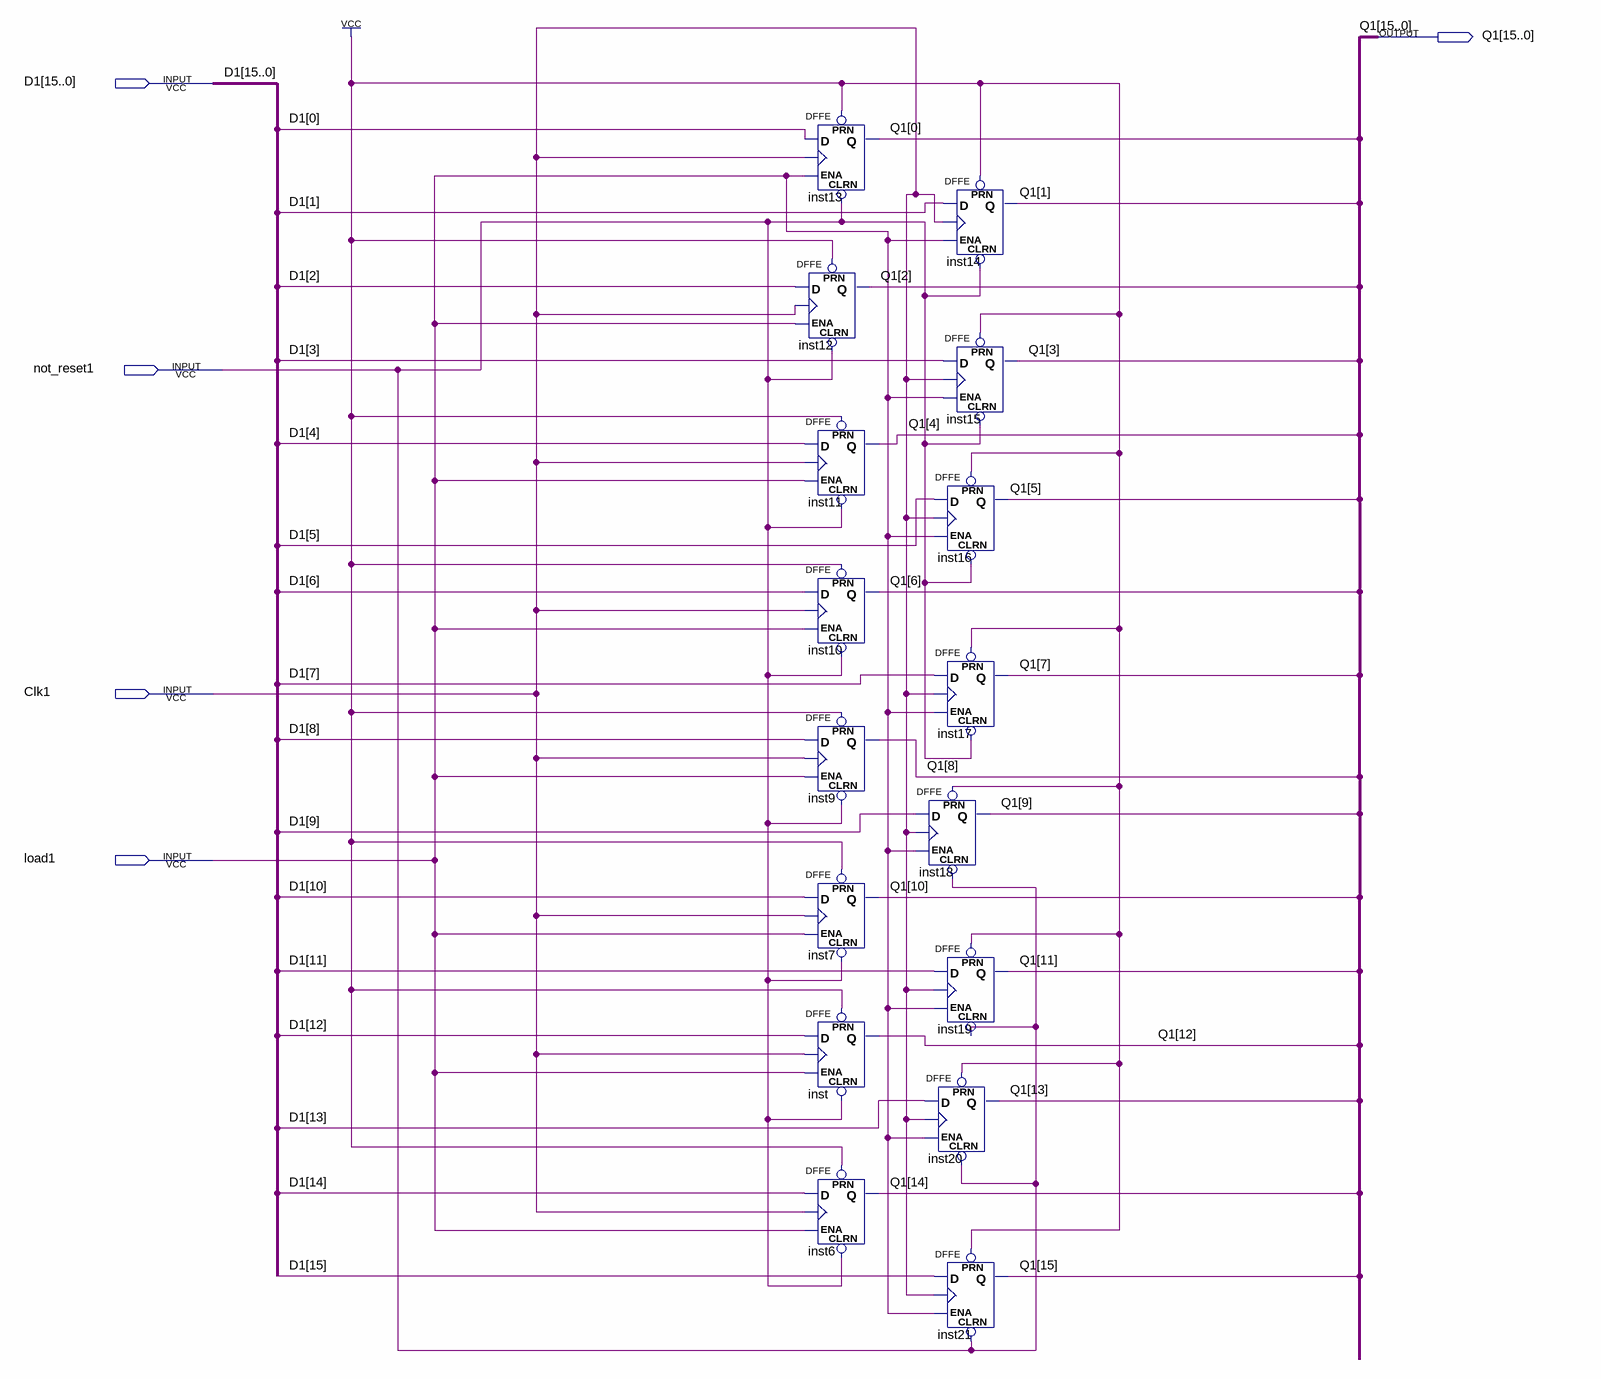
[diagram p0: schematic sheet]
// Quartus schematic register_16bit.bdf as structural Verilog: 16 symbols, 5 pins
module register_16bit (
  input  [15:0] D1,
  input  not_reset1,
  input  Clk1,
  input  load1,
  output [15:0] Q1
);

  DFFE inst13 (.PRN(1'b1), .CLRN(not_reset1), .D(D1[0]), .CLK(Clk1), .ENA(load1), .Q(Q1[0]));
  DFFE inst12 (.PRN(1'b1), .CLRN(not_reset1), .D(D1[2]), .CLK(Clk1), .ENA(load1), .Q(Q1[2]));
  DFFE inst11 (.PRN(1'b1), .CLRN(not_reset1), .D(D1[4]), .CLK(Clk1), .ENA(load1), .Q(Q1[4]));
  DFFE inst10 (.PRN(1'b1), .CLRN(not_reset1), .D(D1[6]), .CLK(Clk1), .ENA(load1), .Q(Q1[6]));
  DFFE inst9 (.PRN(1'b1), .CLRN(not_reset1), .D(D1[8]), .CLK(Clk1), .ENA(load1), .Q(Q1[8]));
  DFFE inst7 (.PRN(1'b1), .CLRN(not_reset1), .D(D1[10]), .CLK(Clk1), .ENA(load1), .Q(Q1[10]));
  DFFE inst (.PRN(1'b1), .CLRN(not_reset1), .D(D1[12]), .CLK(Clk1), .ENA(load1), .Q(Q1[12]));
  DFFE inst6 (.PRN(1'b1), .CLRN(not_reset1), .D(D1[14]), .CLK(Clk1), .ENA(load1), .Q(Q1[14]));
  DFFE inst14 (.PRN(1'b1), .CLRN(not_reset1), .D(D1[1]), .CLK(Clk1), .ENA(load1), .Q(Q1[1]));
  DFFE inst15 (.PRN(1'b1), .CLRN(not_reset1), .D(D1[3]), .CLK(Clk1), .ENA(load1), .Q(Q1[3]));
  DFFE inst16 (.PRN(1'b1), .CLRN(not_reset1), .D(D1[5]), .CLK(Clk1), .ENA(load1), .Q(Q1[5]));
  DFFE inst17 (.PRN(1'b1), .CLRN(not_reset1), .D(D1[7]), .CLK(Clk1), .ENA(load1), .Q(Q1[7]));
  DFFE inst18 (.PRN(1'b1), .CLRN(not_reset1), .D(D1[9]), .CLK(Clk1), .ENA(load1), .Q(Q1[9]));
  DFFE inst19 (.PRN(1'b1), .CLRN(not_reset1), .D(D1[11]), .CLK(Clk1), .ENA(load1), .Q(Q1[11]));
  DFFE inst20 (.PRN(1'b1), .CLRN(not_reset1), .D(D1[13]), .CLK(Clk1), .ENA(load1), .Q(Q1[13]));
  DFFE inst21 (.PRN(1'b1), .CLRN(not_reset1), .D(D1[15]), .CLK(Clk1), .ENA(load1), .Q(Q1[15]));
endmodule
